# EAGLE schematic kitchensink_mini_esp32_v1.2 (EAGLE 9.6.2)

## Sheet 1 of 6
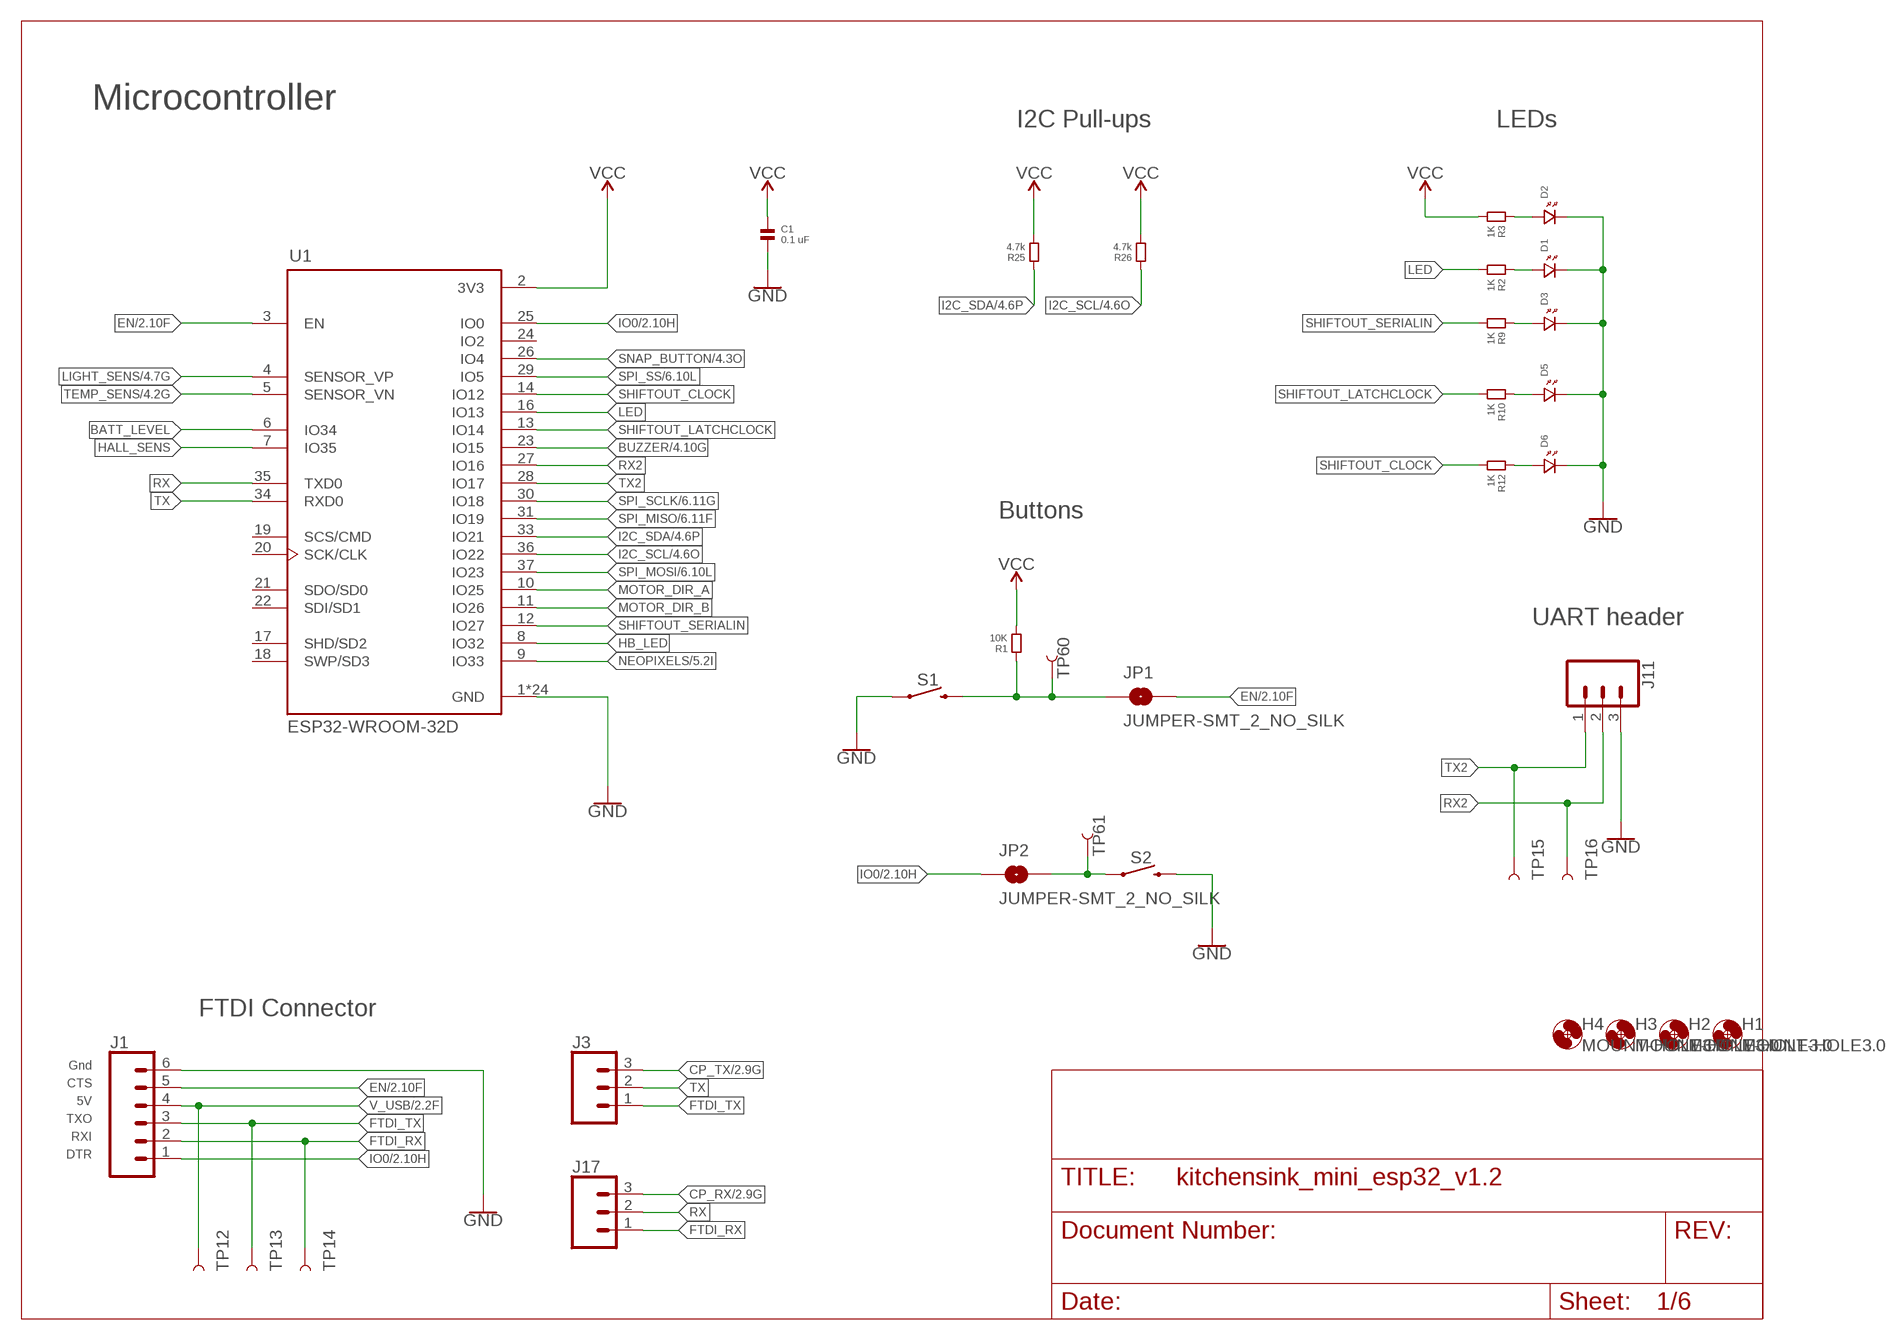
[diagram p0: schematic, sheet 1]

### Parts
C1  0.1 uF  CAPACITOR.1206  [1206]
D1  LED.1206  [1206.LED]
D2  LED.1206  [1206.LED]
D3  LED.1206  [1206.LED]
D5  LED.1206  [1206.LED]
D6  LED.1206  [1206.LED]
H1  MOUNT-HOLE3.0  [3,0]
H2  MOUNT-HOLE3.0  [3,0]
H3  MOUNT-HOLE3.0  [3,0]
H4  MOUNT-HOLE3.0  [3,0]
J1  CONN_06  [1X06-SMD_RA_MALE_NO_HOLES]
J3  CONN_03LONGPADS  [1X03_LONGPADS]
J11  CONN_03SMD_RA_MALE  [1X03_SMD_RA_MALE]
J17  CONN_03LONGPADS  [1X03_LONGPADS]
JP1  JUMPER-SMT_2_NO_SILK  [SMT-JUMPER_2_NO_SILK]
JP2  JUMPER-SMT_2_NO_SILK  [SMT-JUMPER_2_NO_SILK]
R1  10K  RESISTOR.1206  [1206]
R2  1K  RESISTOR.1206  [1206]
R3  1K  RESISTOR.1206  [1206]
R9  1K  RESISTOR.1206  [1206]
R10  1K  RESISTOR.1206  [1206]
R12  1K  RESISTOR.1206  [1206]
R25  4.7k  RESISTOR.1206  [1206]
R26  4.7k  RESISTOR.1206  [1206]
S1  MOMENTARY-SWITCH-SPST-SMD-5.2MM  [TACTILE_SWITCH_SMD_5.2MM]
S2  MOMENTARY-SWITCH-SPST-SMD-5.2MM  [TACTILE_SWITCH_SMD_5.2MM]
TP12  TEST-POINT3X5  [PAD.03X.05]
TP13  TEST-POINT3X5  [PAD.03X.05]
TP14  TEST-POINT3X5  [PAD.03X.05]
TP15  TEST-POINT3X5  [PAD.03X.05]
TP16  TEST-POINT3X5  [PAD.03X.05]
TP60  TEST-POINT3X5  [PAD.03X.05]
TP61  TEST-POINT3X5  [PAD.03X.05]
U1  ESP32-WROOM-32D  [MODULE_ESP32-WROOM-32D]

### Nets
BATT_LEVEL: U1.6(IO34)
BUZZER: U1.23(IO15) ; also sheet 4
CP_RX: J17.3 ; also sheet 2
CP_TX: J3.3 ; also sheet 2
EN: J1.5 JP1.2 U1.3(EN) ; also sheet 2
FTDI_RX: J1.2 J17.1 TP14.P$1
FTDI_TX: J1.3 J3.1 TP13.P$1
GND [power]: D1.P$2 D2.P$2 D3.P$2 D5.P$2 D6.P$2 J1.6 J11.3 S1.1 U1.1(GND) U1.15(GND) U1.38(GND) U1.39_1(GND) U1.39_2(GND) U1.39_3(GND) U1.39_4(GND) U1.39_5(GND) U1.39_6(GND) U1.39_7(GND) U1.39_8(GND) U1.39_9(GND) U1.39_10(GND) U1.39_11(GND) U1.39_12(GND) U1.39_13(GND) U1.39_14(GND) U1.39_15(GND) U1.39_16(GND) U1.39_17(GND) U1.39_18(GND) U1.39_19(GND) U1.39_20(GND) U1.39_21(GND) ; also sheet 2,3,4,5,6
HALL_SENS: U1.7(IO35)
HB_LED: U1.8(IO32)
I2C_SCL: R26.1 U1.36(IO22) ; also sheet 4,6
I2C_SDA: R25.1 U1.33(IO21) ; also sheet 4,6
IO0: J1.1 JP2.1 U1.25(IO0) ; also sheet 2
LED: R2.2 U1.16(IO13)
LIGHT_SENS: U1.4(SENSOR_VP) ; also sheet 4
MOTOR_DIR_A: U1.10(IO25)
MOTOR_DIR_B: U1.11(IO26)
N$2: C1.1 ; supply symbol labelled VCC
N$3: C1.2 S2.3 ; supply symbol labelled GND
N$4: D3.P$1 R9.1
N$7: D1.P$1 R2.1
N$8: D5.P$1 R10.1
N$9: D2.P$1 R3.1
N$13: D6.P$1 R12.1
NEOPIXELS: U1.9(IO33) ; also sheet 5
PRE_EN: JP1.1 R1.1 S1.3 TP60.P$1
PRE_IO0: JP2.2 S2.1 TP61.P$1
RX: J17.2 U1.35(TXD0)
RX2: J11.2 TP16.P$1 U1.27(IO16)
SHIFTOUT_CLOCK: R12.2 U1.14(IO12)
SHIFTOUT_LATCHCLOCK: R10.2 U1.13(IO14)
SHIFTOUT_SERIALIN: R9.2 U1.12(IO27)
SNAP_BUTTON: U1.26(IO4) ; also sheet 4
SPI_MISO: U1.31(IO19) ; also sheet 6
SPI_MOSI: U1.37(IO23) ; also sheet 6
SPI_SCLK: U1.30(IO18) ; also sheet 6
SPI_SS: U1.29(IO5) ; also sheet 6
TEMP_SENS: U1.5(SENSOR_VN) ; also sheet 4
TX: J3.2 U1.34(RXD0)
TX2: J11.1 TP15.P$1 U1.28(IO17)
V_USB [power]: J1.4 TP12.P$1 ; also sheet 2,3
VCC [power]: R1.2 R3.2 R25.2 R26.2 U1.2(3V3) ; also sheet 2,3,4,5,6
Unconnected: U1.17(SHD/SD2) U1.18(SWP/SD3) U1.19(SCS/CMD) U1.20(SCK/CLK) U1.21(SDO/SD0) U1.22(SDI/SD1) U1.24(IO2)

### Notes on the sheet
- Microcontroller
- I2C Pull-ups | LEDs
- Buttons
- UART header
- FTDI Connector
- Gnd
- CTS
- 5V
- TXO
- RXI
- DTR

## Sheet 2 of 6
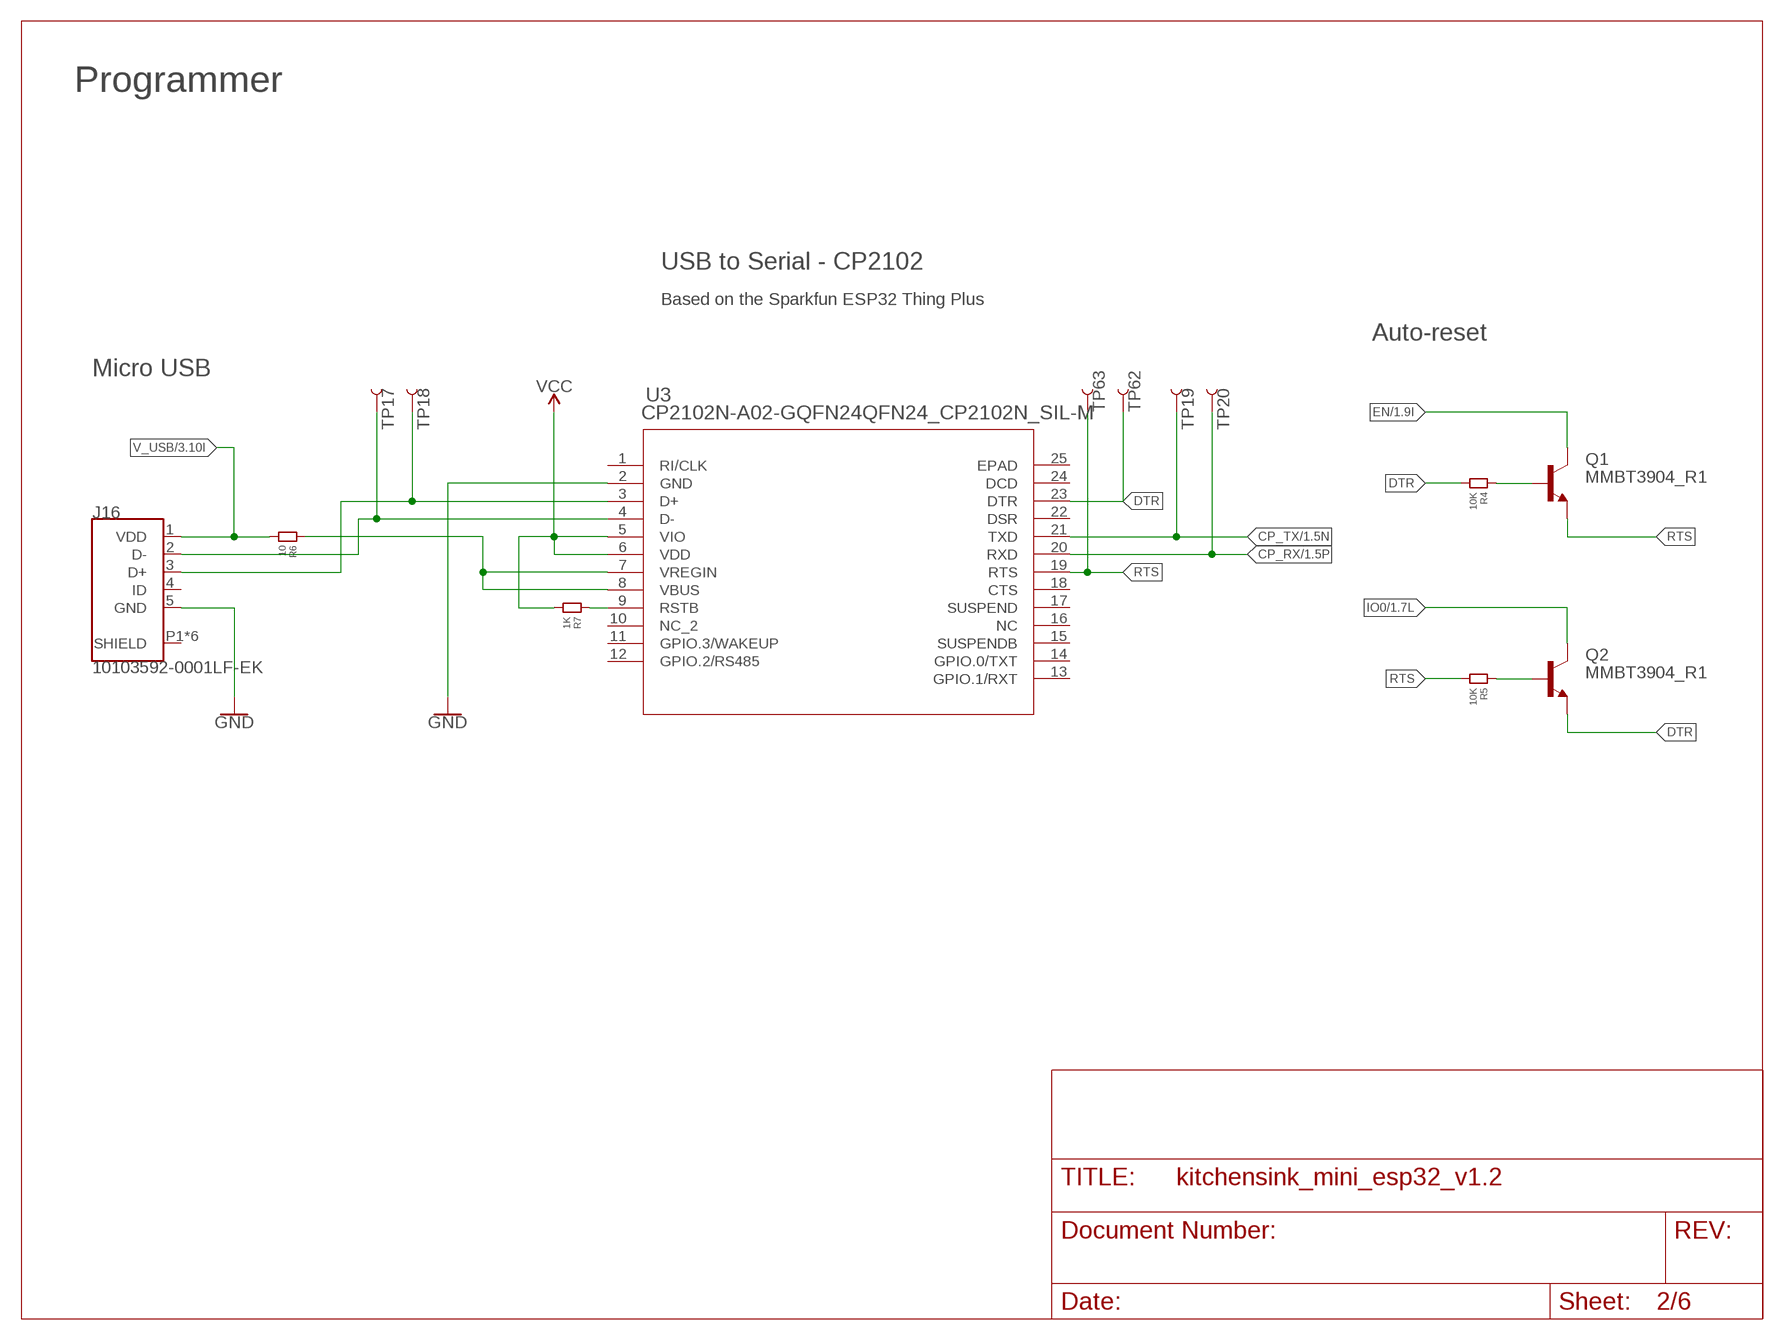
[diagram p1: schematic, sheet 2]

### Parts
J16  10103592-0001LF-EK  [AMPHENOL_10103592-0001LF]
Q1  MMBT3904_R1  BC846  [SOT23]
Q2  MMBT3904_R1  BC846  [SOT23]
R4  10K  RESISTOR.1206  [1206]
R5  10K  RESISTOR.1206  [1206]
R6  10  RESISTOR.1206  [1206]
R7  1K  RESISTOR.1206  [1206]
TP17  TEST-POINT3X5  [PAD.03X.05]
TP18  TEST-POINT3X5  [PAD.03X.05]
TP19  TEST-POINT3X5  [PAD.03X.05]
TP20  TEST-POINT3X5  [PAD.03X.05]
TP62  TEST-POINT3X5  [PAD.03X.05]
TP63  TEST-POINT3X5  [PAD.03X.05]
U3  CP2102N-A02-GQFN24QFN24_CP2102N_SIL-M  [QFN24_CP2102N_SIL-M]

### Nets
CP_RX: TP20.P$1 U3.20(RXD) ; also sheet 1
CP_TX: TP19.P$1 U3.21(TXD) ; also sheet 1
DTR: Q2.2(E) R4.2 TP62.P$1 U3.23(DTR)
EN: Q1.3(C) ; also sheet 1
GND [power]: J16.5(GND) U3.2(GND) ; also sheet 1,3,4,5,6
IO0: Q2.3(C) ; also sheet 1
N$1: R6.1 U3.7(VREGIN) U3.8(VBUS)
N$5: J16.3(D+) TP18.P$1 U3.3(D+)
N$6: J16.2(D-) TP17.P$1 U3.4(D-)
N$10: Q1.1(B) R4.1
N$11: Q2.1(B) R5.1
N$12: R7.1 U3.9(RSTB)
RTS: Q1.2(E) R5.2 TP63.P$1 U3.19(RTS)
V_USB [power]: J16.1(VDD) R6.2 ; also sheet 1,3
VCC [power]: R7.2 U3.5(VIO) U3.6(VDD) ; also sheet 1,3,4,5,6
Unconnected: J16.4(ID) U3.1(RI/CLK) U3.10(NC_2) U3.11(GPIO.3/WAKEUP) U3.12(GPIO.2/RS485) U3.13(GPIO.1/RXT) U3.14(GPIO.0/TXT) U3.15(SUSPENDB) U3.16(NC) U3.17(SUSPEND) U3.18(CTS) U3.22(DSR) U3.24(DCD) U3.25(EPAD)

### Notes on the sheet
- Programmer
- USB to Serial - CP2102
- Based on the Sparkfun ESP32 Thing Plus
- Auto-reset
- Micro USB

## Sheet 3 of 6
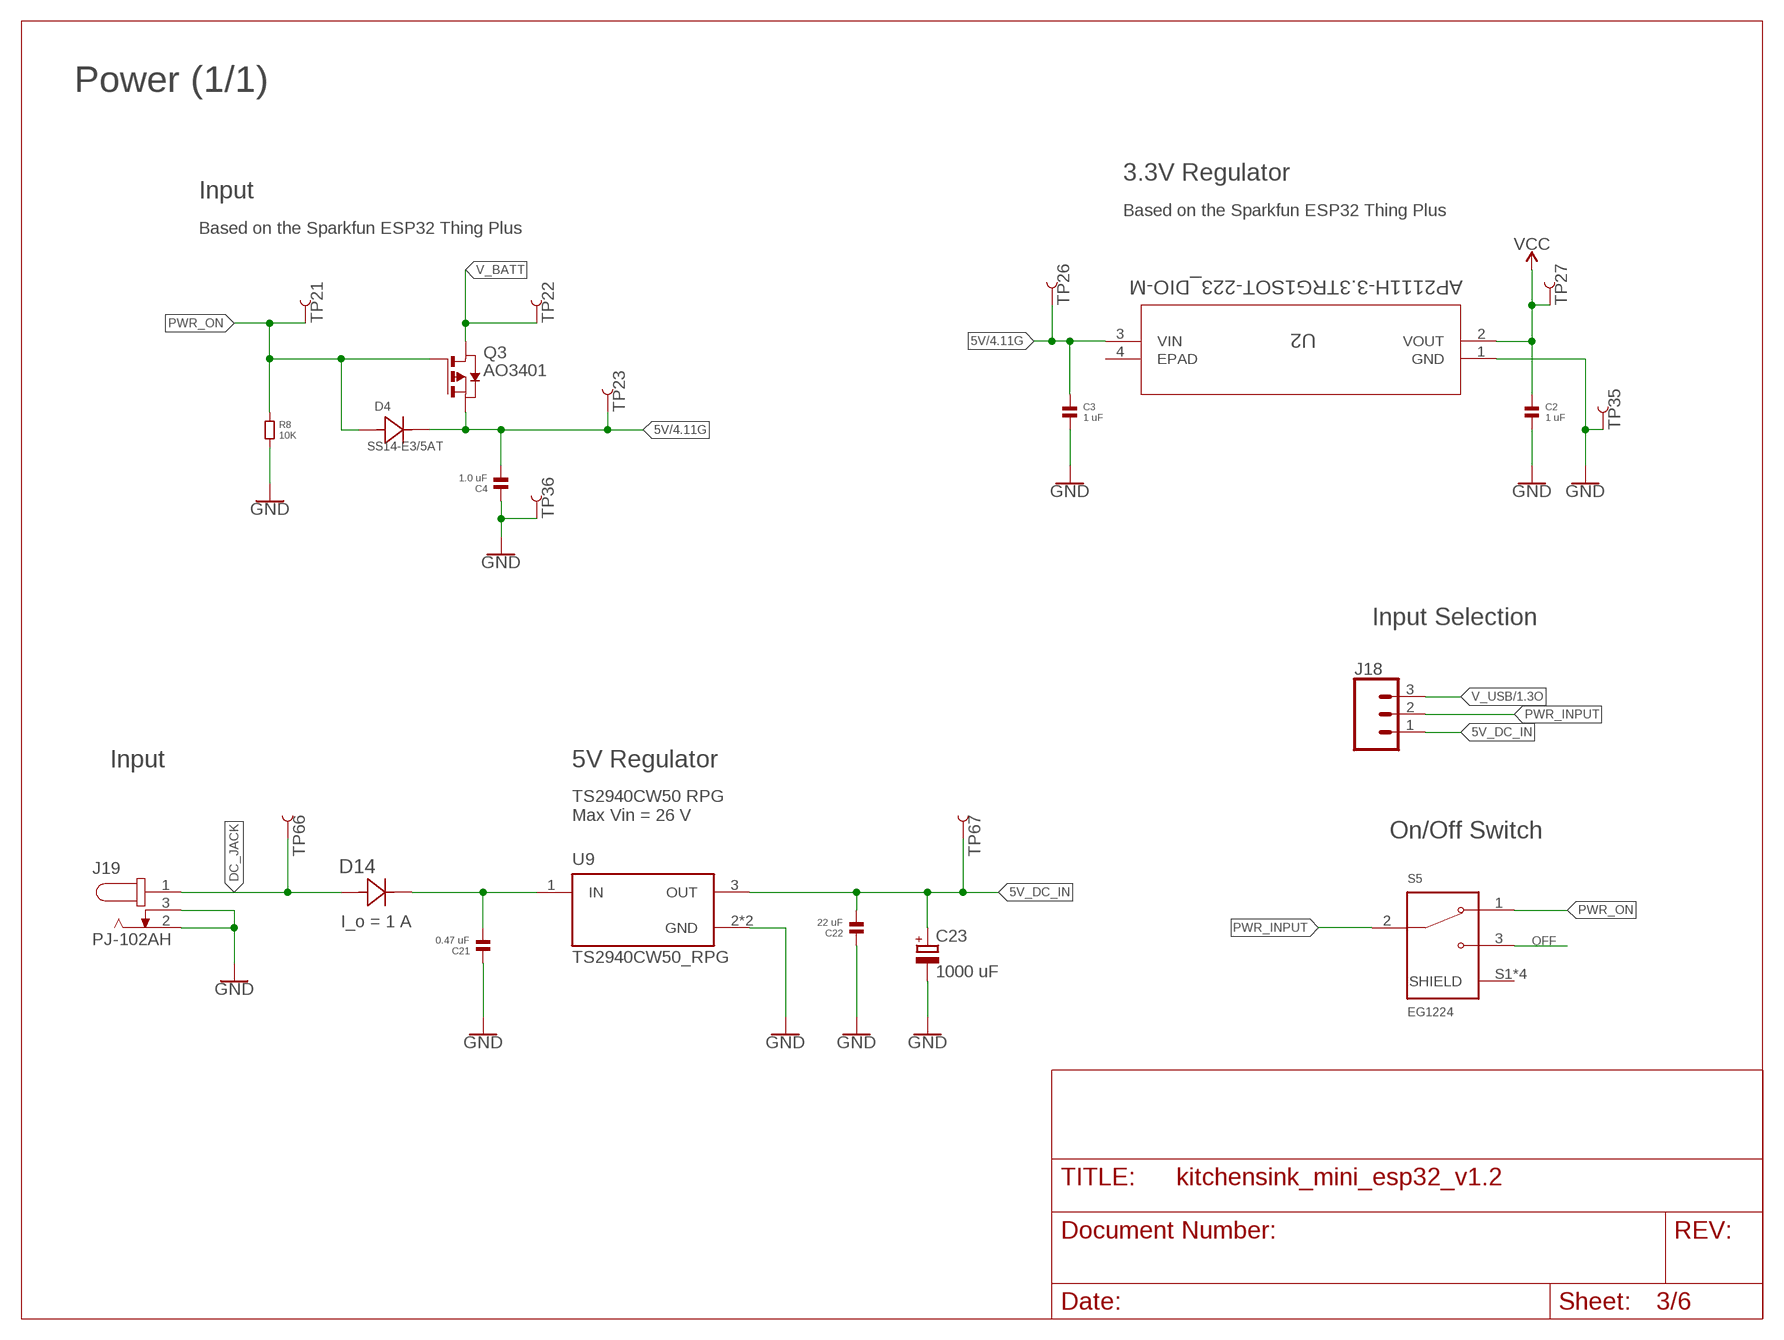
[diagram p2: schematic, sheet 3]

### Parts
C2  1 uF  CAPACITOR.1206  [1206]
C3  1 uF  CAPACITOR.1206  [1206]
C4  1.0 uF  CAPACITOR.1206  [1206]
C21  0.47 uF  CAPACITOR.1206  [1206]
C22  22 uF  CAPACITOR.1206  [1206]
C23  1000 uF  CPOL-EU140CLH-1010  [140CLH-1010]
D4  SS14-E3/5AT  [DIODE_DO214AC]
D14  RS1BB-13-FSMA_DIO-M  [SMA_DIO-M]
J18  CONN_03  [1X03]
J19  PJ-102AH  [CUI_PJ-102AH]
Q3  AO3401  [SOT23]
R8  10K  RESISTOR.1206  [1206]
S5  EG1224  [SW_EG1224]
TP21  TEST-POINT3X5  [PAD.03X.05]
TP22  TEST-POINT3X5  [PAD.03X.05]
TP23  TEST-POINT3X5  [PAD.03X.05]
TP26  TEST-POINT3X5  [PAD.03X.05]
TP27  TEST-POINT3X5  [PAD.03X.05]
TP35  TEST-POINT3X5  [PAD.03X.05]
TP36  TEST-POINT3X5  [PAD.03X.05]
TP66  TEST-POINT3X5  [PAD.03X.05]
TP67  TEST-POINT3X5  [PAD.03X.05]
U2  AP2111H-3.3TRG1SOT-223_DIO-M  [SOT-223_DIO-M]
U9  TS2940CW50_RPG  [VREG_TS2940CW50_RPG]

### Nets
5V [power]: C3.1 C4.2 D4.1 Q3.2(S) TP23.P$1 TP26.P$1 U2.3(VIN) ; also sheet 4,5
5V_DC_IN [power]: C22.2 C23.+ J18.1 TP67.P$1 U9.3(OUT)
DC_JACK [power]: D14.2 J19.1 TP66.P$1
GND [power]: C2.2 C3.2 C4.1 C21.1 C22.1 C23.- J19.2 J19.3 R8.2 TP35.P$1 TP36.P$1 U2.1(GND) U9.2(GND) U9.4(GND) ; also sheet 1,2,4,5,6
N$14: C21.2 D14.1 U9.1(IN)
OFF: S5.3
PWR_INPUT [power]: J18.2 S5.2
PWR_ON [power]: D4.2 Q3.1(G) R8.1 S5.1 TP21.P$1
V_BATT: Q3.3(D) TP22.P$1
V_USB [power]: J18.3 ; also sheet 1,2
VCC [power]: C2.1 TP27.P$1 U2.2(VOUT) ; also sheet 1,2,4,5,6
Unconnected: S5.S1(SHIELD) S5.S2(SHIELD) S5.S3(SHIELD) S5.S4(SHIELD) U2.4(EPAD)

### Notes on the sheet
- Power (1/1)
- 3.3V Regulator
- Input
- Based on the Sparkfun ESP32 Thing Plus
- Based on the Sparkfun ESP32 Thing Plus
- Input Selection
- Input | 5V Regulator
- TS2940CW50 RPG
  Max Vin = 26 V
- On/Off Switch
- I_o = 1 A

## Sheet 4 of 6
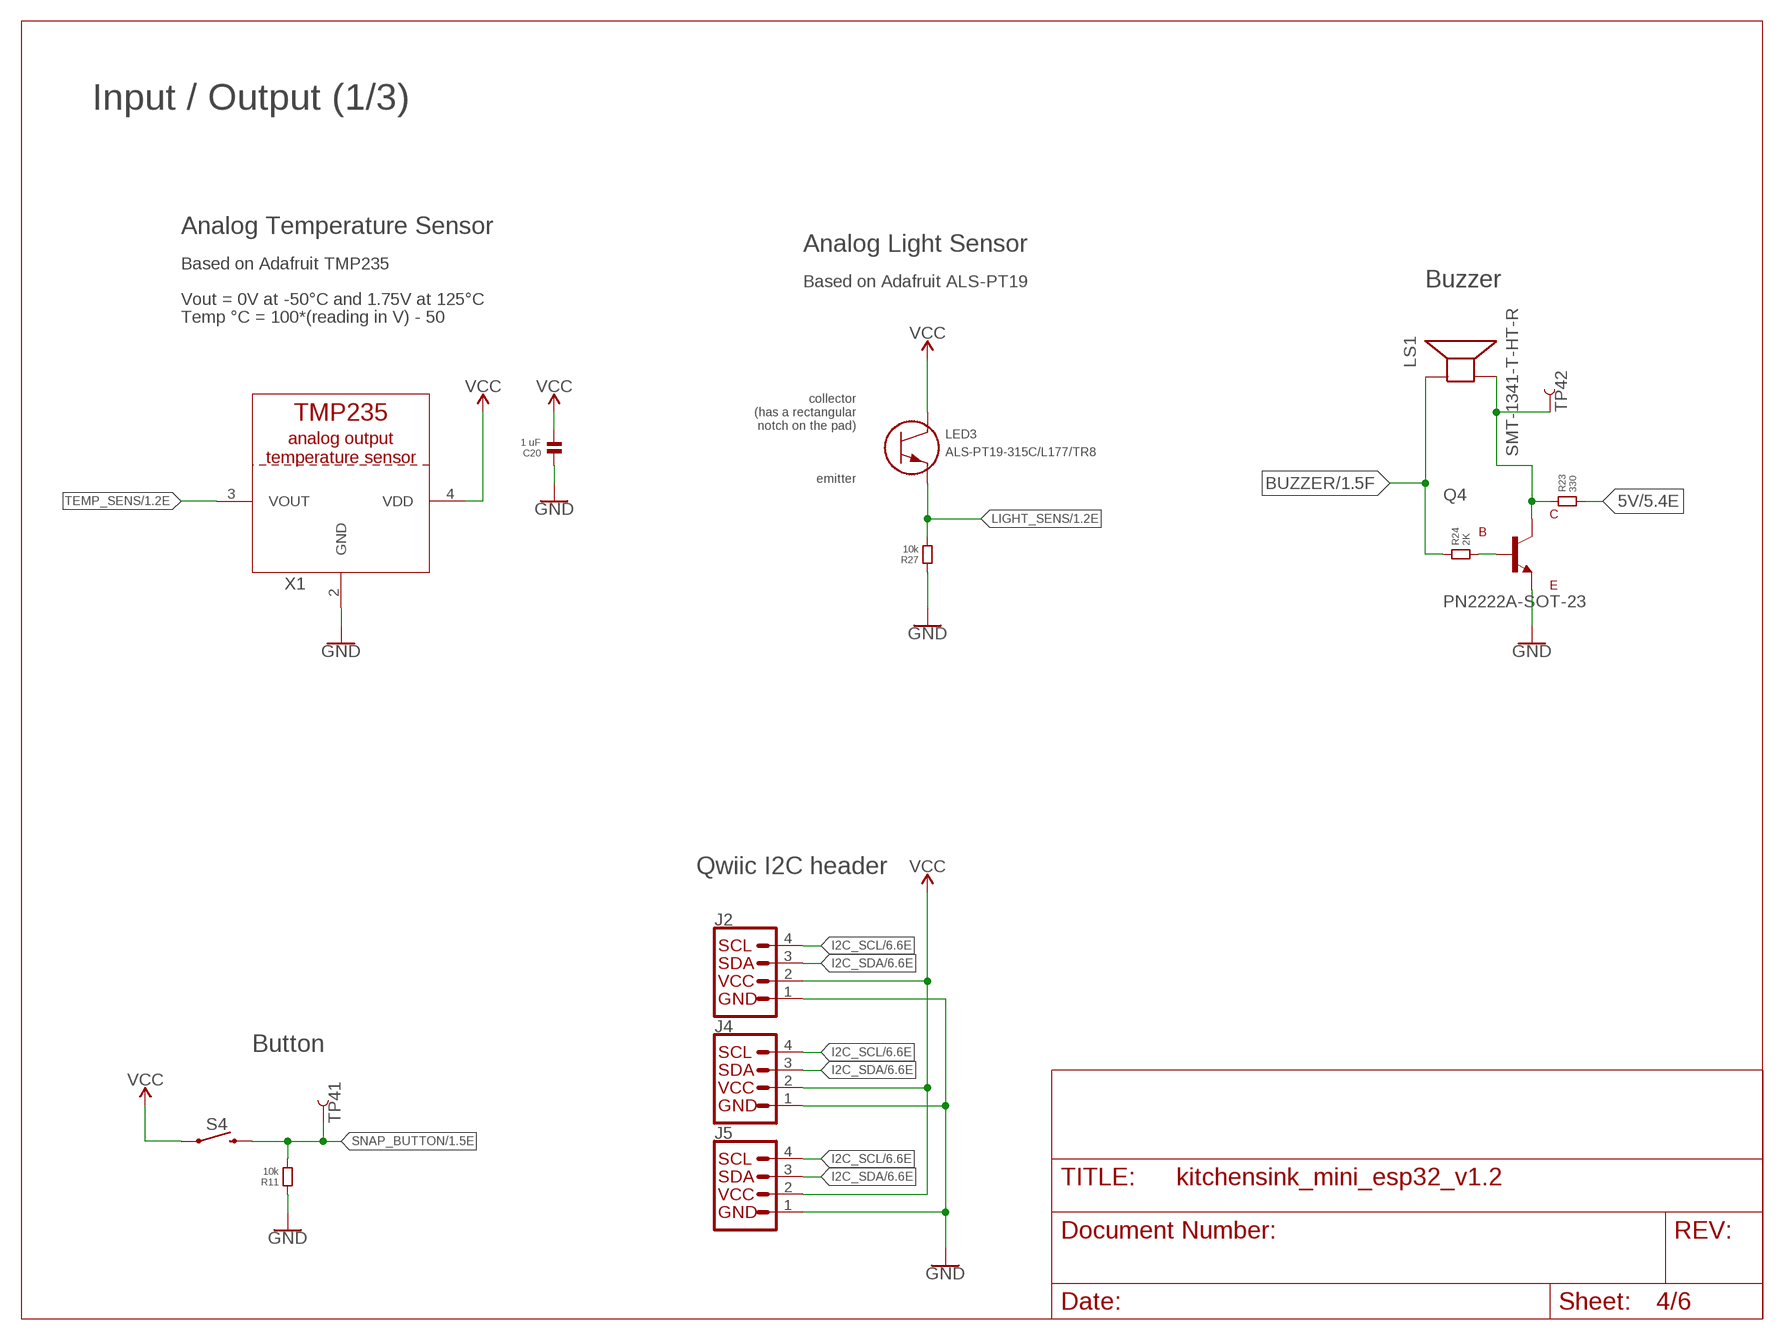
[diagram p3: schematic, sheet 4]

### Parts
C20  1 uF  CAPACITOR.1206  [1206]
J2  QWIIC_CONNECTORJS-1MM  [1X04_1MM_RA]
J4  QWIIC_CONNECTORJS-1MM  [1X04_1MM_RA]
J5  QWIIC_CONNECTORJS-1MM  [1X04_1MM_RA]
LED3  ALS-PT19-315C/L177/TR8  [LED_77/TR8_EVE]
LS1  SMT-1341-T-HT-R  [XDCR_SMT-1341-T-HT-R]
Q4  PN2222A-SOT-23  [PN2222A-SOT-23]
R11  10k  RESISTOR.1206  [1206]
R23  330  RESISTOR.1206  [1206]
R24  2K  RESISTOR.1206  [1206]
R27  10k  RESISTOR.1206  [1206]
S4  MOMENTARY-SWITCH-SPST-SMD-5.2MM  [TACTILE_SWITCH_SMD_5.2MM]
TP41  TEST-POINT3X5  [PAD.03X.05]
TP42  TEST-POINT3X5  [PAD.03X.05]
X1  TMP235_DCKR  [SC70-5]

### Nets
5V [power]: R23.2 ; also sheet 3,5
BUZZER: LS1.P R24.1 ; also sheet 1
GND [power]: C20.1 J2.1(GND) J4.1(GND) J5.1(GND) Q4.EMITTER R11.1 R27.1 X1.2(GND) ; also sheet 1,2,3,5,6
I2C_SCL: J2.4(SCL) J4.4(SCL) J5.4(SCL) ; also sheet 1,6
I2C_SDA: J2.3(SDA) J4.3(SDA) J5.3(SDA) ; also sheet 1,6
LIGHT_SENS: LED3.2 R27.2 ; also sheet 1
N$33: LS1.N Q4.COLLECTOR R23.1 TP42.P$1
N$35: Q4.BASE R24.2
SNAP_BUTTON: R11.2 S4.3 TP41.P$1 ; also sheet 1
TEMP_SENS: X1.3(VOUT) ; also sheet 1
VCC [power]: C20.2 J2.2(VCC) J4.2(VCC) J5.2(VCC) LED3.1 S4.1 X1.4(VDD) ; also sheet 1,2,3,5,6

### Notes on the sheet
- Input / Output (1/3)
- Analog Temperature Sensor
- Analog Light Sensor
- Based on Adafruit TMP235
- Based on Adafruit ALS-PT19 | Buzzer
- Vout = 0V at -50°C and 1.75V at 125°C
- Temp °C = 100*(reading in V) - 50
- collector
  (has a rectangular
  notch on the pad)
- emitter
- Qwiic I2C header
- Button

## Sheet 5 of 6
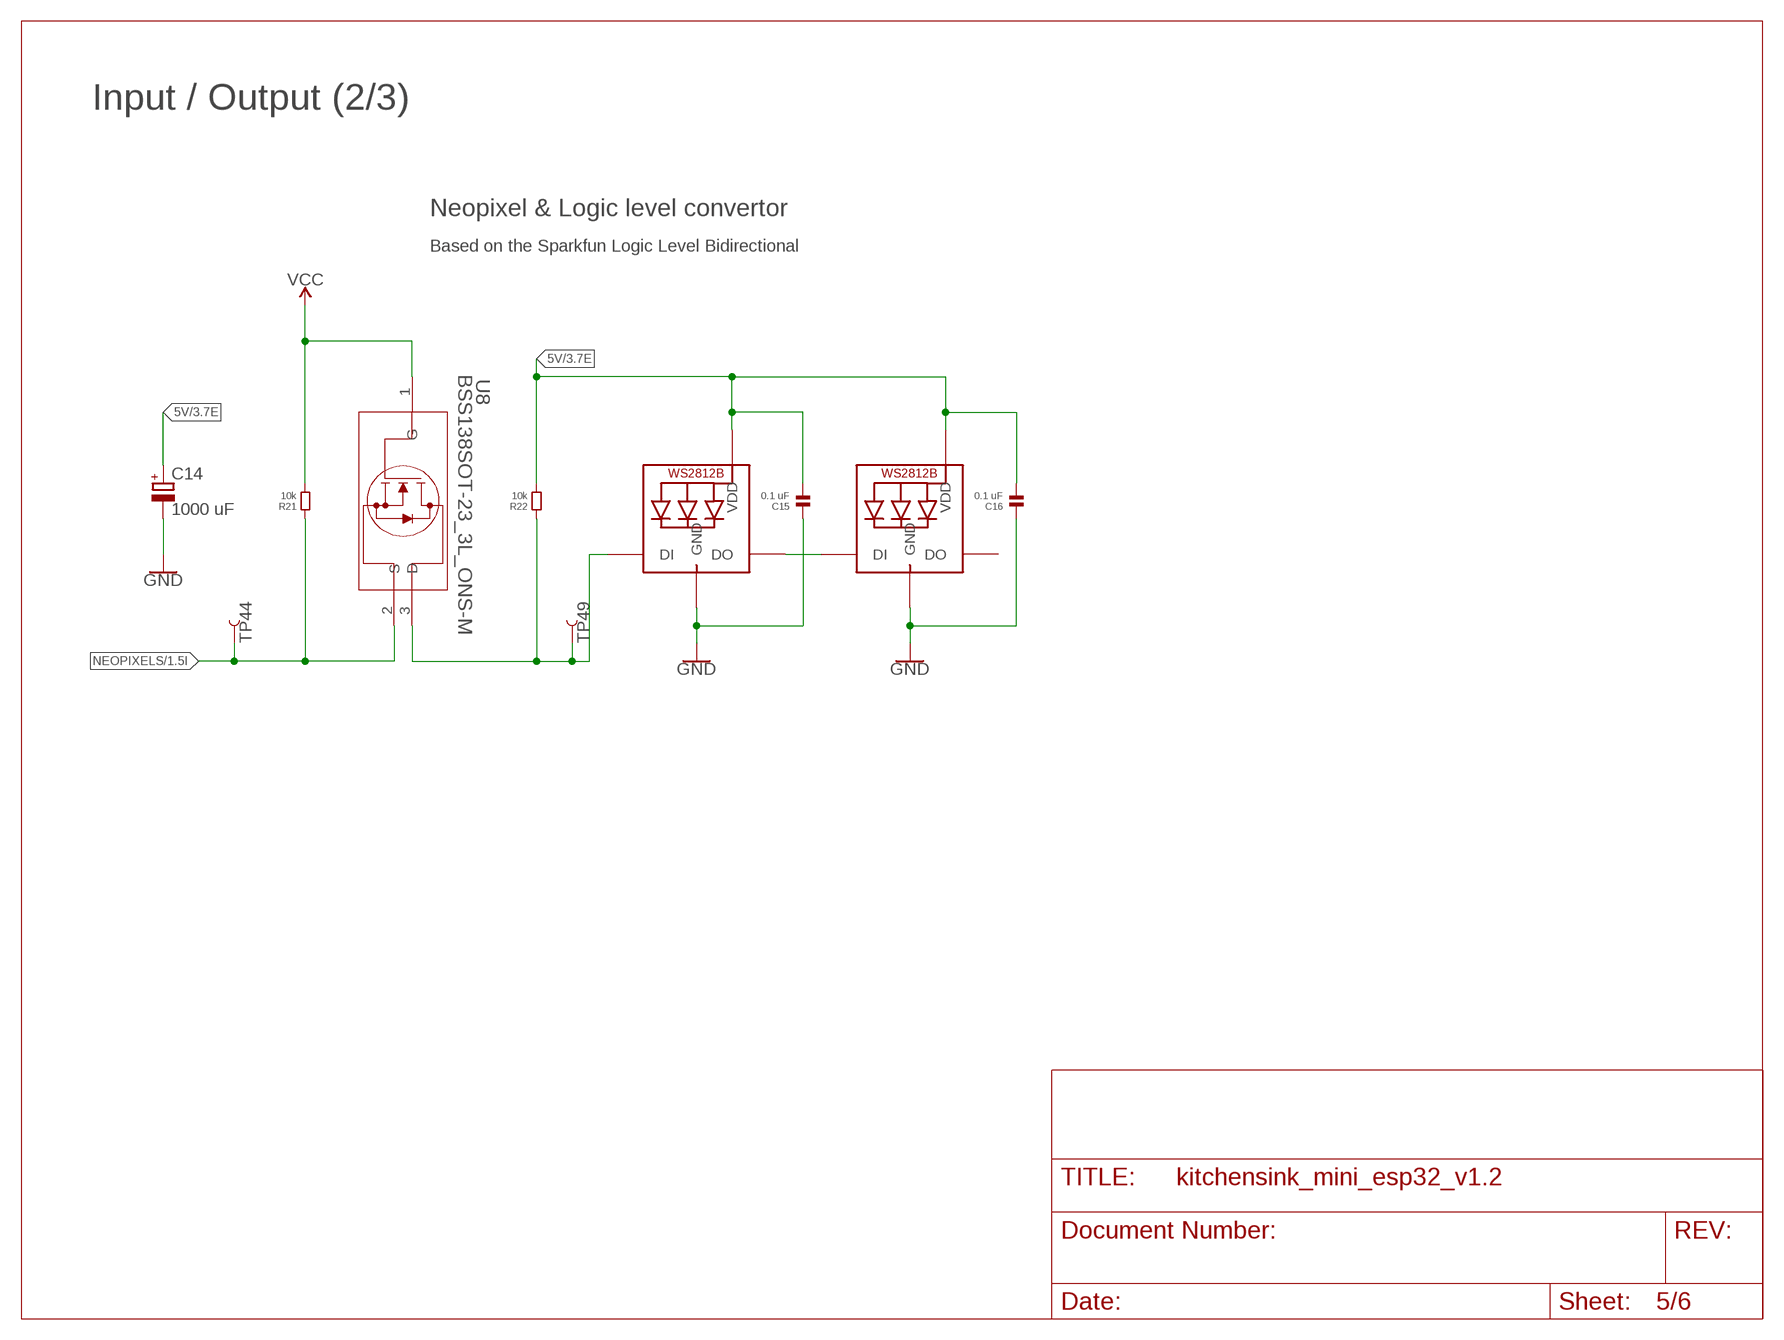
[diagram p4: schematic, sheet 5]

### Parts
C14  1000 uF  CPOL-EU140CLH-1010  [140CLH-1010]
C15  0.1 uF  CAPACITOR.1206  [1206]
C16  0.1 uF  CAPACITOR.1206  [1206]
LED1  WS2812B5050  [WS2812B]
LED2  WS2812B5050  [WS2812B]
R21  10k  RESISTOR.1206  [1206]
R22  10k  RESISTOR.1206  [1206]
TP44  TEST-POINT3X5  [PAD.03X.05]
TP49  TEST-POINT3X5  [PAD.03X.05]
U8  BSS138SOT-23_3L_ONS-M  [SOT-23_3L_ONS-M]

### Nets
5V [power]: C14.+ C15.2 C16.2 LED1.1-VDD(VDD) LED2.1-VDD(VDD) R22.2 ; also sheet 3,4
GND [power]: C14.- C15.1 C16.1 LED1.3-GND(GND) LED2.3-GND(GND) ; also sheet 1,2,3,4,6
N$30: LED1.4-DIN(DI) R22.1 TP49.P$1 U8.3(D)
N$34: LED1.2-DOUT(DO) LED2.4-DIN(DI)
NEOPIXELS: R21.1 TP44.P$1 U8.2(S) ; also sheet 1
VCC [power]: R21.2 U8.1(G) ; also sheet 1,2,3,4,6
Unconnected: LED2.2-DOUT(DO)

### Notes on the sheet
- Input / Output (2/3)
- Neopixel & Logic level convertor
- Based on the Sparkfun Logic Level Bidirectional

## Sheet 6 of 6
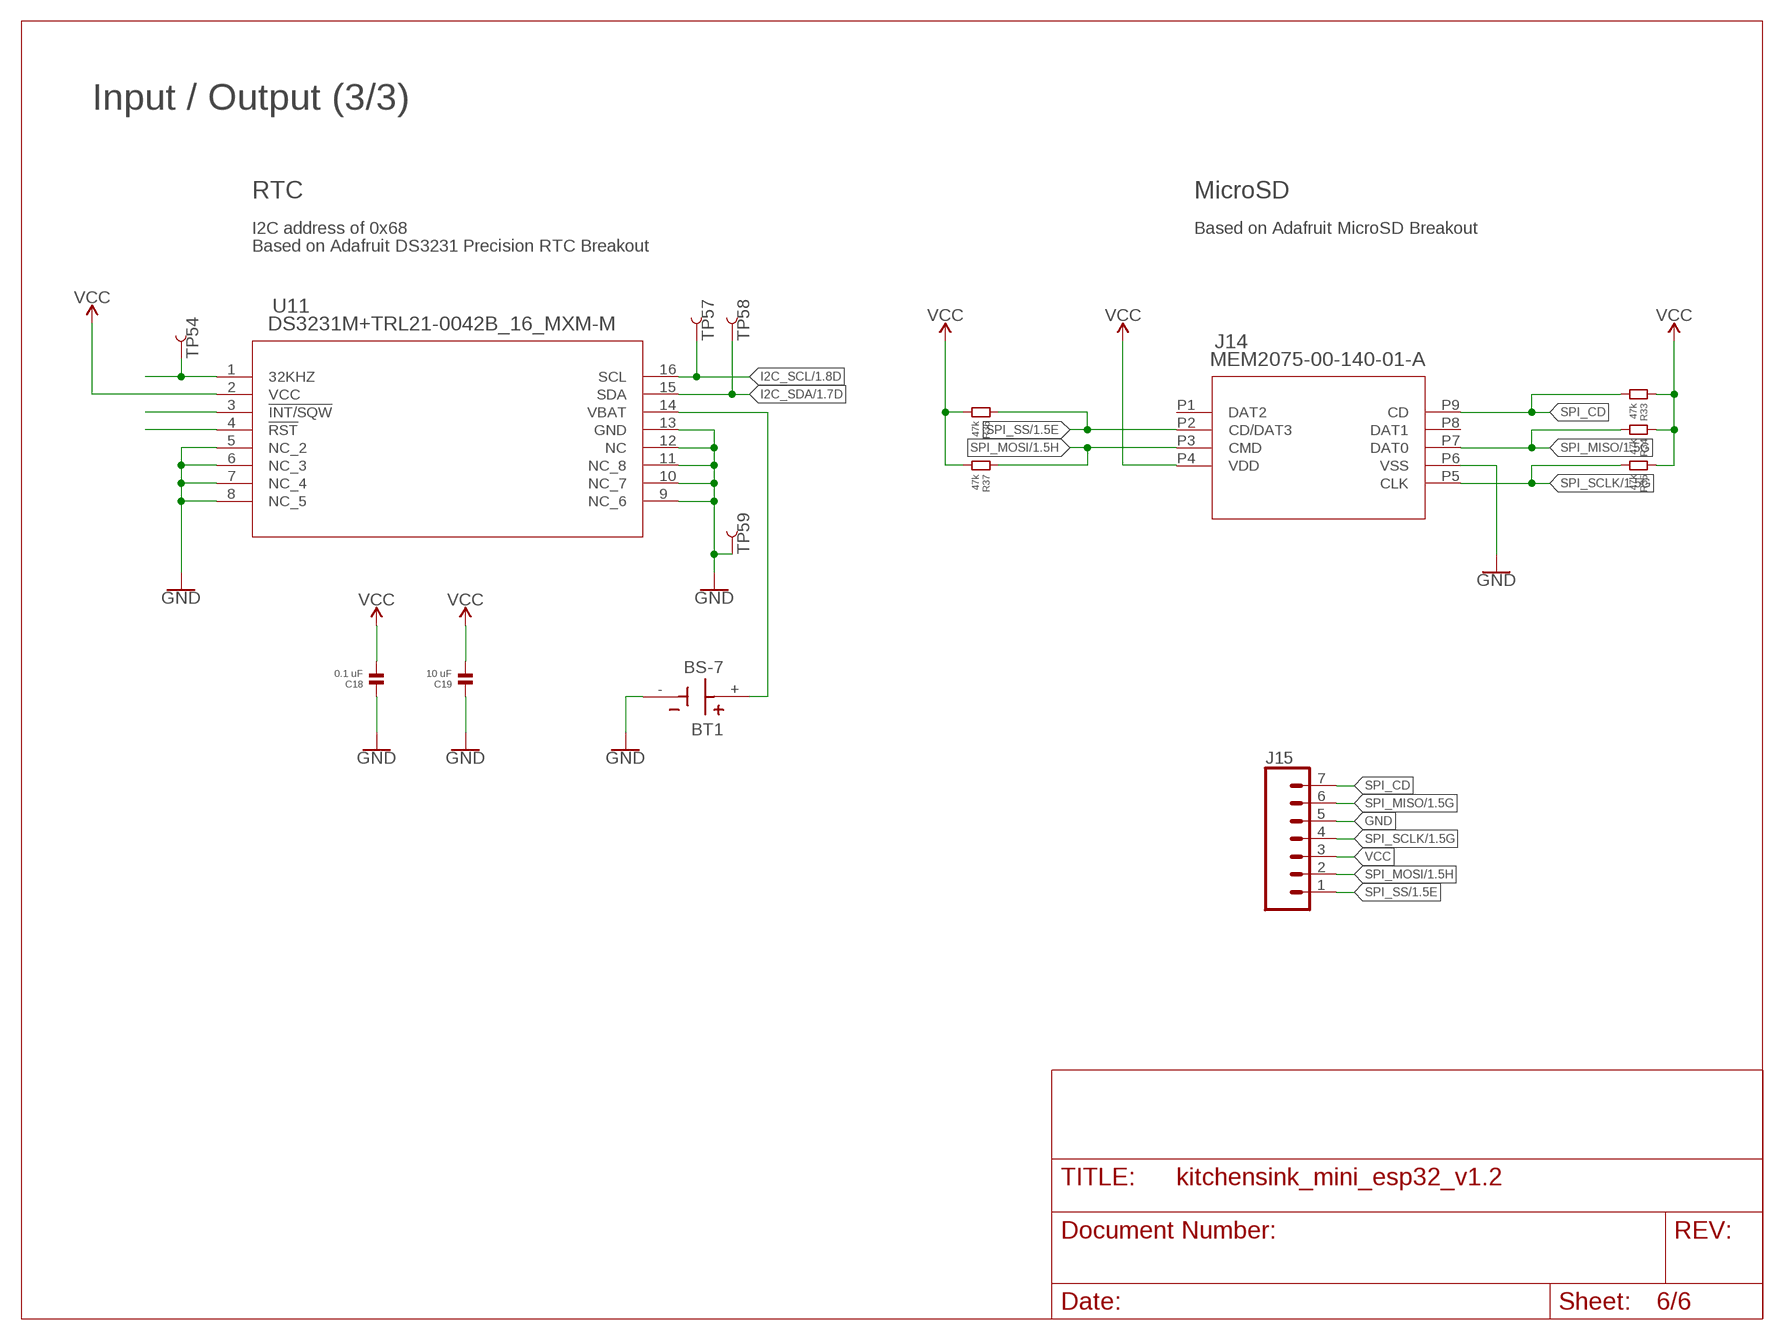
[diagram p5: schematic, sheet 6]

### Parts
BT1  BS-7  [BAT_BS-7]
C18  0.1 uF  CAPACITOR.1206  [1206]
C19  10 uF  CAPACITOR.1206  [1206]
J14  MEM2075-00-140-01-A  [MEM2075-00-140-01-A_GCT]
J15  CONN_07LONGPADS  [1X07_LONGPADS]
R33  47k  RESISTOR.1206  [1206]
R34  47k  RESISTOR.1206  [1206]
R35  47k  RESISTOR.1206  [1206]
R36  47k  RESISTOR.1206  [1206]
R37  47k  RESISTOR.1206  [1206]
TP54  TEST-POINT3X5  [PAD.03X.05]
TP57  TEST-POINT3X5  [PAD.03X.05]
TP58  TEST-POINT3X5  [PAD.03X.05]
TP59  TEST-POINT3X5  [PAD.03X.05]
U11  DS3231M+TRL21-0042B_16_MXM-M  [21-0042B_16_MXM-M]

### Nets
GND [power]: BT1.- C18.1 C19.1 J14.P6(VSS) J15.5 TP59.P$1 U11.5(NC_2) U11.6(NC_3) U11.7(NC_4) U11.8(NC_5) U11.9(NC_6) U11.10(NC_7) U11.11(NC_8) U11.12(NC) U11.13(GND) ; also sheet 1,2,3,4,5
I2C_SCL: TP57.P$1 U11.16(SCL) ; also sheet 1,4
I2C_SDA: TP58.P$1 U11.15(SDA) ; also sheet 1,4
N$18: TP54.P$1 U11.1(32KHZ)
N$19: U11.3(!INT/SQW)
N$23: U11.4(!RST)
N$24: BT1.+ U11.14(VBAT)
SPI_CD: J14.P9(CD) J15.7 R33.2
SPI_MISO: J14.P7(DAT0) J15.6 R34.2 ; also sheet 1
SPI_MOSI: J14.P3(CMD) J15.2 R37.1 ; also sheet 1
SPI_SCLK: J14.P5(CLK) J15.4 R35.2 ; also sheet 1
SPI_SS: J14.P2(CD/DAT3) J15.1 R36.1 ; also sheet 1
VCC [power]: C18.2 C19.2 J14.P4(VDD) J15.3 R33.1 R34.1 R35.1 R36.2 R37.2 U11.2(VCC) ; also sheet 1,2,3,4,5
Unconnected: J14.P1(DAT2) J14.P8(DAT1)

### Notes on the sheet
- Input / Output (3/3)
- RTC | MicroSD
- I2C address of 0x68 | Based on Adafruit MicroSD Breakout
- Based on Adafruit DS3231 Precision RTC Breakout

## Power pins joined to a net without a drawn wire
SHIELD: J16.P1(SHIELD) J16.P2(SHIELD) J16.P3(SHIELD) J16.P4(SHIELD) J16.P5(SHIELD) J16.P6(SHIELD)

## Library data of the parts
BT1 = UltraLibrarianParts:BS-7: BATTERY HOLDER COIN 20MM PC PIN Check availability <https://pricing.snapeda.com/parts/BS-7/MPD%20%28Memory/view-part?ref=eda>; AVAILABILITY: In Stock; DESCRIPTION: BATTERY HOLDER COIN 20MM PC PIN; MF: MPD (Memory; MP: BS-7; PACKAGE: None; PRICE: None; PURCHASE-URL: https://pricing.snapeda.com/search/part/BS-7/?ref=eda
C1-C4 C15 C16 C18-C22 = standardparts:CAPACITOR
C14 C23 = rcl:CPOL-EU: POLARIZED CAPACITOR, European symbol; SPICEPREFIX: C
D1-D3 D5 D6 = standardparts:LED
D4 = UltraLibrarianParts:SS14-E3/5AT; COPYRIGHT: Copyright (C) 2022 Ultra Librarian. All rights reserved.; DIGI-KEY_PART_NUMBER_1: SS14-E3/5ATGICT-ND; DIGI-KEY_PART_NUMBER_2: SS14-E3/5ATGIDKR-ND; DIGI-KEY_PART_NUMBER_3: SS14-E3/5ATGITR-ND; MANUFACTURER_PART_NUMBER: SS14-E3/5AT; MFR_NAME: Vishay
D14 = UltraLibrarianParts:RS1BB-13-F; COPYRIGHT: Copyright (C) 2022 Ultra Librarian. All rights reserved.; DIGI-KEY_PART_NUMBER_1: RS1BB-FDICT-ND; DIGI-KEY_PART_NUMBER_2: RS1BB-FDIDKR-ND; DIGI-KEY_PART_NUMBER_3: RS1BB-FDITR-ND; MANUFACTURER_PART_NUMBER: RS1BB-13-F; MFR_NAME: Diodes Inc
H1-H4 = holes:MOUNT-HOLE: MOUNTING HOLE with drill center marker
J1 = Hippo-PS:CONN_06: Multi connection point. Often used as Generic Header-pin footprint for 0.1 inch spaced/style header connections On any of the 0.1 inch spaced packages, you can populate with these: Break Away Headers - Straight <https://www.sparkfun.com/products/116> (PRT-00116) Break Away Male Headers - Right Angle <https://www.sparkfun.com/products/553> (PRT-00553) Female Headers <https://www.sparkfun.com/products/115> (PRT-00115) Break Away Headers - Machine Pin <https://www.sparkfun.com/products/117> (PRT-00117) Break Away Female Headers - Swiss Machine Pin <https://www.sparkfun.com/products/743> (PRT-00743) Arduino Stackable Header - 6 Pin <https://www.sparkfun.com/products/9280> (PRT-09280) For SCREWTERMINALS and SPRING TERMINALS visit here: Screw Terimnals on SparkFun.com <https://www.sparkfun.com/search/results?term=Screw+Terminals> (5mm/3.5mm/2.54mm spacing) This device is also useful as a general connection point to wire up your design to another part of your project. Our various solder wires solder well into these plated through hole pads. Hook-Up Wire - Assortment (Stranded, 22 AWG) <https://www.sparkfun.com/products/11375> (PRT-11375) Hook-Up Wire - Assortment (Solid Core, 22 AWG) <https://www.sparkfun.com/products/11367> (PRT-11367) View the entire wire category on our website here <https://www.sparkfun.com/categories/141>
J2 J4 J5 = SparkFun-Connectors:QWIIC_CONNECTOR: SparkFun I2C Standard Qwiic Connector An SMD 1mm pitch JST connector makes it easy and quick (get it? Qwiic?) to connect I2C devices to each other. The Qwiic system <http://www.sparkfun.com/qwiic> enables fast and solderless connection between popular platforms and various sensors and actuators. We carry 200mm <https://www.sparkfun.com/products/14204>, 100mm <https://www.sparkfun.com/products/14205>, 50mm <https://www.sparkfun.com/products/14206>, and breadboard friendly <https://www.sparkfun.com/products/14207> Qwiic cables. We also offer 10 pcs strips <https://www.sparkfun.com/products/14323> the SMD connectors.
J3 J17 J18 = SparkFun-Connectors:CONN_03: Multi connection point. Often used as Generic Header-pin footprint for 0.1 inch spaced/style header connections On any of the 0.1 inch spaced packages, you can populate with these: Break Away Headers - Straight <https://www.sparkfun.com/products/116> (PRT-00116) Break Away Male Headers - Right Angle <https://www.sparkfun.com/products/553> (PRT-00553) Female Headers <https://www.sparkfun.com/products/115> (PRT-00115) Break Away Headers - Machine Pin <https://www.sparkfun.com/products/117> (PRT-00117) Break Away Female Headers - Swiss Machine Pin <https://www.sparkfun.com/products/743> (PRT-00743) Stackable Header - 3 Pin (Female, 0.1") <https://www.sparkfun.com/products/13875> (PRT-13875) For SCREWTERMINALS and SPRING TERMINALS visit here: Screw Terimnals on SparkFun.com <https://www.sparkfun.com/search/results?term=Screw+Terminals> (5mm/3.5mm/2.54mm spacing) This device is also useful as a general connection point to wire up your design to another part of your project. Our various solder wires solder well into these plated through hole pads. Hook-Up Wire - Assortment (Stranded, 22 AWG) <https://www.sparkfun.com/products/11375> (PRT-11375) Hook-Up Wire - Assortment (Solid Core, 22 AWG) <https://www.sparkfun.com/products/11367> (PRT-11367) View the entire wire category on our website here <https://www.sparkfun.com/categories/141> Special notes: Molex polarized connector foot print use with SKU : PRT-08232 with associated crimp pins and housings.
J11 = SparkFun-Connectors:CONN_03: Multi connection point. Often used as Generic Header-pin footprint for 0.1 inch spaced/style header connections On any of the 0.1 inch spaced packages, you can populate with these: Break Away Headers - Straight <https://www.sparkfun.com/products/116> (PRT-00116) Break Away Male Headers - Right Angle <https://www.sparkfun.com/products/553> (PRT-00553) Female Headers <https://www.sparkfun.com/products/115> (PRT-00115) Break Away Headers - Machine Pin <https://www.sparkfun.com/products/117> (PRT-00117) Break Away Female Headers - Swiss Machine Pin <https://www.sparkfun.com/products/743> (PRT-00743) Stackable Header - 3 Pin (Female, 0.1") <https://www.sparkfun.com/products/13875> (PRT-13875) For SCREWTERMINALS and SPRING TERMINALS visit here: Screw Terimnals on SparkFun.com <https://www.sparkfun.com/search/results?term=Screw+Terminals> (5mm/3.5mm/2.54mm spacing) This device is also useful as a general connection point to wire up your design to another part of your project. Our various solder wires solder well into these plated through hole pads. Hook-Up Wire - Assortment (Stranded, 22 AWG) <https://www.sparkfun.com/products/11375> (PRT-11375) Hook-Up Wire - Assortment (Solid Core, 22 AWG) <https://www.sparkfun.com/products/11367> (PRT-11367) View the entire wire category on our website here <https://www.sparkfun.com/categories/141> Special notes: Molex polarized connector foot print use with SKU : PRT-08232 with associated crimp pins and housings.; PROD_ID: CONN-10925
J14 = UltraLibrarianParts:MEM2075-00-140-01-A; COPYRIGHT: Copyright (C) 2022 Ultra Librarian. All rights reserved.; DIGI-KEY_PART_NUMBER_1: 2073-MEM2075-00-140-01-ACT-ND; DIGI-KEY_PART_NUMBER_2: 2073-MEM2075-00-140-01-ADKR-ND; DIGI-KEY_PART_NUMBER_3: 2073-MEM2075-00-140-01-ATR-ND; MANUFACTURER_PART_NUMBER: MEM2075-00-140-01-A; MFR_NAME: Global Connector Technology
J15 = SparkFun-Connectors:CONN_07: Multi connection point. Often used as Generic Header-pin footprint for 0.1 inch spaced/style header connections On any of the 0.1 inch spaced packages, you can populate with these: Break Away Headers - Straight <https://www.sparkfun.com/products/116> (PRT-00116) Break Away Male Headers - Right Angle <https://www.sparkfun.com/products/553> (PRT-00553) Female Headers <https://www.sparkfun.com/products/115> (PRT-00115) Break Away Headers - Machine Pin <https://www.sparkfun.com/products/117> (PRT-00117) Break Away Female Headers - Swiss Machine Pin <https://www.sparkfun.com/products/743> (PRT-00743) For SCREWTERMINALS and SPRING TERMINALS visit here: Screw Terimnals on SparkFun.com <https://www.sparkfun.com/search/results?term=Screw+Terminals> (5mm/3.5mm/2.54mm spacing) This device is also useful as a general connection point to wire up your design to another part of your project. Our various solder wires solder well into these plated through hole pads. Hook-Up Wire - Assortment (Stranded, 22 AWG) <https://www.sparkfun.com/products/11375> (PRT-11375) Hook-Up Wire - Assortment (Solid Core, 22 AWG) <https://www.sparkfun.com/products/11367> (PRT-11367) View the entire wire category on our website here <https://www.sparkfun.com/categories/141> Special notes: Molex polarized connector foot print use with SKU : PRT-08231 with associated crimp pins and housings. 1MM SMD Version SKU: PRT-10208 NOTES ON THE VARIANTS LOCK and LOCK_LONGPADS... This footprint was designed to help hold the alignment of a through-hole component (i.e. 6-pin header) while soldering it into place. You may notice that each hole has been shifted either up or down by 0.005 of an inch from it's more standard position (which is a perfectly straight line). This slight alteration caused the pins (the squares in the middle) to touch the edges of the holes. Because they are alternating, it causes a "brace" to hold the component in place. 0.005 has proven to be the perfect amount of "off-center" position when using our standard breakaway headers. Although looks a little odd when you look at the bare footprint, once you have a header in there, the alteration is very hard to notice. Also,if you push a header all the way into place, it is covered up entirely on the bottom side.
J16 = UltraLibrarianParts:10103592-0001LF-EK: Conn Micro USB Type B RCP 5 POS 0.65mm Solder RA SMD 5 Terminal 1 Port T/R; ARROW_ELECTRONICS-PURCHASE-URL: https://snapeda.com/shop?store=Arrow+Electronics&id=1274744; DESCRIPTION: USB - micro B USB 2.0 Receptacle Connector 5 Position Surface Mount, Right Angle; Through Hole; DIGI-KEY_PART_NUMBER: 609-4048-1-ND; DIGIKEY-PURCHASE-URL: https://snapeda.com/shop?store=DigiKey&id=1274744; MF: Amphenol ICC; MOUSER-PURCHASE-URL: https://snapeda.com/shop?store=Mouser&id=1274744; MP: 10103592-0001LF; PACKAGE: None
J19 = UltraLibrarianParts:PJ-102AH: 2.0 mm Center Pin, 5.0 A, Right Angle, Through Hole, Tapered Pins, Dc Power Jack Connector; CUI_PURCHASE_URL: https://www.cuidevices.com/product/interconnect/connectors/dc-power-connectors/jacks/pj-102ah?utm_source=snapeda.com&utm_medium=referral&utm_campaign=snapedaBOM; DESCRIPTION: 2.0 x 6.5 mm, 5.0 A, Horizontal, Through Hole, Tapered Pins, Dc Power Jack Connector; DIGI-KEY_PART_NUMBER: CP-102AH-ND; MF: CUI Devices; MP: PJ-102AH; PACKAGE: None; PURCHASE-URL: https://pricing.snapeda.com/search/part/PJ-102AH/?ref=eda
JP1 JP2 = SparkFun-Jumpers:JUMPER-SMT_2_NO: Normally open jumper This jumper has two pads in close proximity to each other. Apply solder to close the connection. Round pads are easier to solder for beginners, but are a lot larger. SparkFun Product that uses the round pads: SparkFun EL Sequencer <https://www.sparkfun.com/products/12781>
LED1 LED2 = UltraLibrarianParts:WS2812B: Check availability <https://pricing.snapeda.com/parts/WS2812B/SparkFun%20Electronics/view-part?ref=eda>; AVAILABILITY: Not in stock; DESCRIPTION: Raspberry Pi HAT (40 pin) Wheeled Robotics Kit; MF: SparkFun Electronics; MP: WS2812B; PACKAGE: None; PRICE: None
LED3 = UltraLibrarianParts:ALS-PT19-315C/L177/TR8; COPYRIGHT: Copyright (C) 2022 Ultra Librarian. All rights reserved.; DIGI-KEY_PART_NUMBER_1: 1080-1244-2-ND; DIGI-KEY_PART_NUMBER_2: 1080-1244-1-ND; DIGI-KEY_PART_NUMBER_3: 1080-1244-6-ND; MANUFACTURER_PART_NUMBER: ALS-PT19-315C/L177/TR8; MFR_NAME: Everlight
LS1 = UltraLibrarianParts:SMT-1341-T-HT-R; DESCRIPTION: SURFACE MOUNT TRANSDUCER 5 VP-P; DIGI-KEY_PART_NUMBER: 668-SMT-1341-T-HT-RTR-ND; MF: PUI Audio, Inc.; MP: SMT-1341-T-HT-R; PACKAGE: PUI Audio, Inc.; PURCHASE-URL: https://pricing.snapeda.com/search/part/SMT-1341-T-HT-R/?ref=eda
Q1 Q2 = BC846:BC846: NPN TRANSISTOR Check availability <https://pricing.snapeda.com/parts/BC846/Rectron/view-part?ref=eda>; AVAILABILITY: In Stock; DESCRIPTION: Trans GP BJT NPN 65V 0.1A 3-Pin SOT-23; MF: Rectron; MP: BC846; PACKAGE: SOT-23-3 Rectron; PRICE: None
Q3 = AO3401:AO3401: Check availability <https://pricing.snapeda.com/parts/AO3401/Alpha%20%26%20Omega%20Semiconductor/view-part?ref=eda>; AVAILABILITY: In Stock; DESCRIPTION: P-Channel 30 V 4A (Ta) 1.4W (Ta) Surface Mount SOT-23-3; MF: Alpha & Omega Semiconductor; MP: AO3401; PACKAGE: SOT-23-3 Alpha &amp; Omega Semiconductor; PRICE: None; PURCHASE-URL: https://pricing.snapeda.com/search/part/AO3401/?ref=eda
Q4 = Hippo-PS:PN2222A-SOT-23: MMBT3904 series 40V 200mA SOT23 NPN Switching Transistor Check availability <https://pricing.snapeda.com/parts/MMBT3904%2C215/Nexperia%20USA/view-part?ref=eda>; AVAILABILITY: In Stock; DESCRIPTION: Bipolar (BJT) Transistor NPN 40 V 200 mA 300MHz 250 mW Surface Mount TO-236AB; MF: Nexperia USA; MP: MMBT3904,215; PACKAGE: SOT23-3 Nexperia USA Inc.; PRICE: None; PURCHASE-URL: https://pricing.snapeda.com/search/part/MMBT3904,215/?ref=eda
R1-R12 R21-R27 R33-R37 = standardparts:RESISTOR
S1 S2 S4 = SparkFun-Switches:MOMENTARY-SWITCH-SPST: Momentary Switch (Pushbutton) - SPST Normally-open (NO) SPST momentary switches (buttons, pushbuttons). Variants PTH-12MM - 12mm square, through-hole Momentary Pushbutton Switch - 12mm Square <https://www.sparkfun.com/products/9190> (COM-09190) PTH-6.0MM, PTH-6.0MM-KIT - 6.0mm square, through-hole Mini Pushbutton Switch <https://www.sparkfun.com/products/97> (COM-00097) KIT package intended for soldering kit's - only one side of pads' copper is exposed. PTH-RIGHT-ANGLE-KIT - Right-angle, through-hole Right Angle Tactile Button <https://www.sparkfun.com/products/10791> - Used on SparkFun BigTime Watch Kit <https://www.sparkfun.com/products/11734> SMD-12MM - 12mm square, surface-mount Tactile Button - SMD (12mm) <https://www.sparkfun.com/products/12993> (COM-12993) Used on SparkFun PicoBoard <https://www.sparkfun.com/products/11888> SMD-4.5MM - 4.5mm Square Trackball Switch Used on SparkFun Blackberry Trackballer Breakout <https://www.sparkfun.com/products/13169> SMD-4.6MMX2.8MM - 4.60mm x 2.80mm, surface mount Used on SparkFun SAMD21 Mini Breakout <https://www.sparkfun.com/products/13664> SMD-5.2MM, SMD-5.2-REDUNDANT - 5.2mm square, surface-mount Mini Pushbutton Switch - SMD <https://www.sparkfun.com/products/8720> (COM-08720) Used on Arduino Pro Mini <https://www.sparkfun.com/products/11114> REDUNDANT package connects both switch circuits together SMD-6.0X3.5MM - 6.0 x 3.5mm, surface mount Momentary Reset Switch SMD <https://www.sparkfun.com/products/8229> (COM-08229) SMD-6.2MM-TALL - 6.2mm square, surface mount Tactile Button - SMD (6mm) <https://www.sparkfun.com/products/12992> Used on SparkFun Digital Sandbox <https://www.sparkfun.com/products/12651> SMD-RIGHT-ANGLE - Right-angle, surface mount Used on SparkFun Block for Intel® Edison - Arduino <https://www.sparkfun.com/products/13036>; PROD_ID: SWCH-08247; SF_SKU: COM-08720
S5 = UltraLibrarianParts:EG1224; DESCRIPTION: Slide Switch SPDT Through Hole, Right Angle; DIGI-KEY_PART_NUMBER: EG2585-ND; MF: E-Switch; MP: EG1224; PACKAGE: None; PURCHASE-URL: https://pricing.snapeda.com/search/part/EG1224/?ref=eda
TP12-TP23 TP26 TP27 TP35 TP36 TP41 TP42 TP44 TP49 TP54 TP57-TP63 TP66 TP67 = SparkFun-Connectors:TEST-POINT: SparkFun Test Points Bare copper test points for troubleshooting or In-Circuit-Testing. These are used by our Production team for verifying production board runs using pogo-pins on test beds. SparkFun Products: SparkFun LSM9DS1 Breakout <https://www.sparkfun.com/products/13284> SparkFun PSOC <https://www.sparkfun.com/products/13714> SparkFun Load Cell Amplifier <https://www.sparkfun.com/products/13879>
U1 = ESP32-WROOM-32D:ESP32-WROOM-32D: Bluetooth, WiFi 802.11b/g/n, Bluetooth v4.2 + EDR, Class 1, 2 and 3 Transceiver Module 2.4GHz ~ 2.5GHz Integrated, Trace Surface Mount Check availability <https://pricing.snapeda.com/parts/ESP32-WROOM-32D/Espressif%20Systems/view-part?ref=eda>; AVAILABILITY: In Stock; DESCRIPTION: Bluetooth, WiFi 802.11b/g/n, Bluetooth v4.2 +EDR, Class 1, 2 and 3 Transceiver Module 2.4GHz ~ 2.5GHz Integrated; MF: Espressif Systems; MP: ESP32-WROOM-32D; PACKAGE: Module Espressif Systems; PRICE: None; PURCHASE-URL: https://pricing.snapeda.com/search/part/ESP32-WROOM-32D/?ref=eda
U2 = AP2111H-3.3TRG1:AP2111H-3.3TRG1; COPYRIGHT: Copyright (C) 2022 Ultra Librarian. All rights reserved.; DIGI-KEY_PART_NUMBER_1: AP2111H-3.3TRG1DICT-ND; DIGI-KEY_PART_NUMBER_2: AP2111H-3.3TRG1DIDKR-ND; DIGI-KEY_PART_NUMBER_3: AP2111H-3.3TRG1DITR-ND; MANUFACTURER_PART_NUMBER: AP2111H-3.3TRG1; MFR_NAME: Diodes Inc
U3 = CP2102N-A02-GQFN24:CP2102N-A02-GQFN24; COPYRIGHT: Copyright (C) 2022 Ultra Librarian. All rights reserved.; DIGI-KEY_PART_NUMBER_1: 336-5887-ND; MANUFACTURER_PART_NUMBER: CP2102N-A02-GQFN24; MFR_NAME: Silicon Labs
U8 = UltraLibrarianParts:BSS138; COPYRIGHT: Copyright (C) 2022 Ultra Librarian. All rights reserved.; DIGI-KEY_PART_NUMBER_1: 1801-BSS138CT-ND; DIGI-KEY_PART_NUMBER_2: 1801-BSS138DKR-ND; DIGI-KEY_PART_NUMBER_3: 1801-BSS138TR-ND; DIGI-KEY_PART_NUMBER_4: 2156-BSS138-ND; DIGI-KEY_PART_NUMBER_5: 2156-BSS138-OS-ND; DIGI-KEY_PART_NUMBER_6: BSS138-DIE-ND; DIGI-KEY_PART_NUMBER_7: BSS138CT-ND; DIGI-KEY_PART_NUMBER_8: BSS138DKR-ND; DIGI-KEY_PART_NUMBER_9: BSS138TR-ND; MANUFACTURER_PART_NUMBER: BSS138; MFR_NAME: onsemi
U9 = UltraLibrarianParts:TS2940CW50_RPG; DESCRIPTION: 1A 5V ULTRA LOW DROPOUT VOLTAGE REGULATOR; DIGI-KEY_PART_NUMBER: 1801-TS2940CW50RPGTR-ND; MF: Taiwan Semiconductor Corporation; MP: TS2940CW50 RPG; PACKAGE: SOT-223 Taiwan Semiconductor; PURCHASE-URL: https://pricing.snapeda.com/search/part/TS2940CW50 RPG/?ref=eda
U11 = UltraLibrarianParts:DS3231M+TRL; COPYRIGHT: Copyright (C) 2022 Ultra Librarian. All rights reserved.; DIGI-KEY_PART_NUMBER_1: DS3231M+TRL-ND; DIGI-KEY_PART_NUMBER_2: DS3231M+TRLCT-ND; DIGI-KEY_PART_NUMBER_3: DS3231M+TRLDKR-ND; DIGI-KEY_PART_NUMBER_4: DS3231M+TRLTR-ND; MANUFACTURER_PART_NUMBER: DS3231M+TRL; MFR_NAME: Maxim Integrated Products
X1 = adafruit_sensor:TMP235

## Net classes
1 power: width 0.381 mm